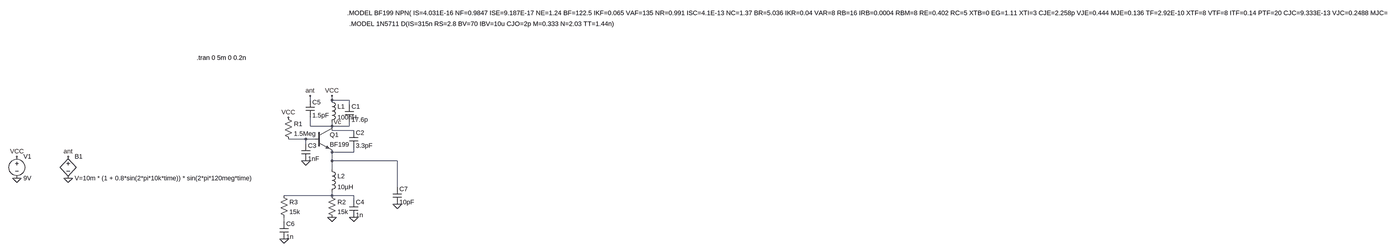
[diagram p0: schematic VHF Airband Receiver.asc, whole sheet]
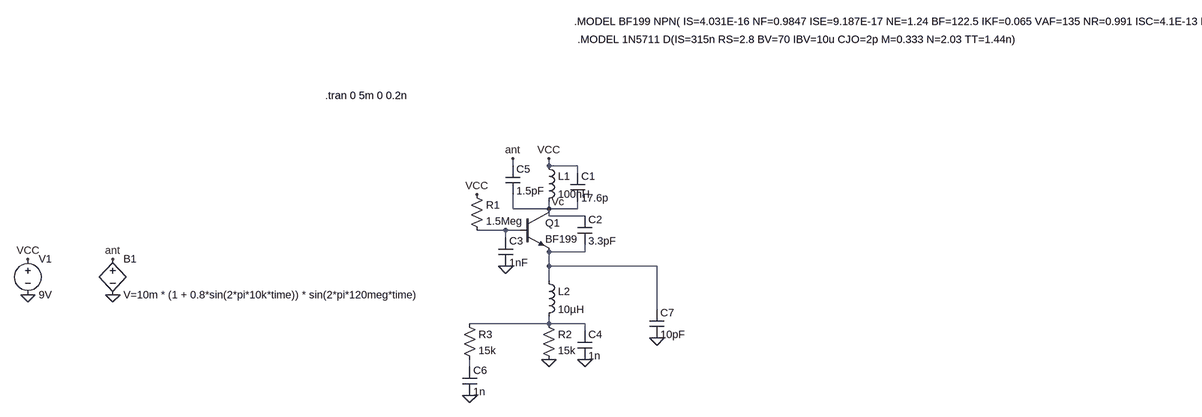
[diagram p1: schematic VHF Airband Receiver.asc, part, row 1 of 1, column 1 of 2]
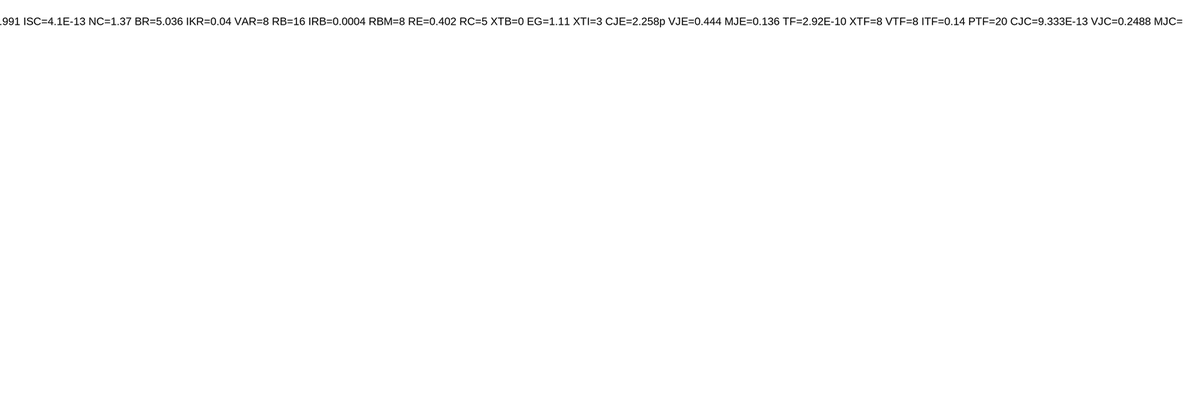
[diagram p2: schematic VHF Airband Receiver.asc, part, row 1 of 1, column 2 of 2]
VHF Airband Receiver.asc, the LTspice schematic file:
Version 4.1
SHEET 1 5172 1060
WIRE 112 320 112 304
WIRE 192 320 192 304
WIRE 256 320 192 320
WIRE 256 336 256 320
WIRE 112 416 112 384
WIRE 192 416 192 400
WIRE 192 416 112 416
WIRE 256 416 256 400
WIRE 256 416 192 416
WIRE 192 432 192 416
WIRE 272 432 192 432
WIRE 96 464 32 464
WIRE 128 464 96 464
WIRE 96 480 96 464
WIRE 272 512 272 496
WIRE 272 512 192 512
WIRE 192 544 192 512
WIRE 432 544 192 544
WIRE 192 576 192 544
WIRE 432 640 432 544
WIRE 192 672 192 656
WIRE 192 672 16 672
WIRE 272 672 192 672
WIRE 272 688 272 672
WIRE 16 768 16 752
FLAG -1056 608 0
FLAG -1056 528 VCC
FLAG 192 304 VCC
FLAG 192 416 Vc
FLAG 96 544 0
FLAG 32 384 VCC
FLAG 112 304 ant
FLAG 192 752 0
FLAG 272 752 0
FLAG 16 832 0
FLAG -864 608 0
FLAG -864 528 ant
FLAG 432 704 0
SYMBOL npn 128 416 R0
SYMATTR InstName Q1
SYMATTR Value BF199
SYMBOL voltage -1056 512 R0
WINDOW 123 0 0 Left 0
WINDOW 39 0 0 Left 0
SYMATTR InstName V1
SYMATTR Value 9V
SYMBOL ind 176 304 R0
SYMATTR InstName L1
SYMATTR Value 100nH
SYMATTR SpiceLine Rser=1m
SYMBOL cap 240 336 R0
SYMATTR InstName C1
SYMATTR Value 17.6p
SYMBOL cap 256 432 R0
SYMATTR InstName C2
SYMATTR Value 3.3pF
SYMBOL res 16 368 R0
SYMATTR InstName R1
SYMATTR Value 1.5Meg
SYMBOL cap 80 480 R0
SYMATTR InstName C3
SYMATTR Value 1nF
SYMBOL cap 96 320 R0
SYMATTR InstName C5
SYMATTR Value 1.5pF
SYMBOL ind 176 560 R0
SYMATTR InstName L2
SYMATTR Value 10µH
SYMATTR SpiceLine Rser=1m
SYMBOL res 176 656 R0
SYMATTR InstName R2
SYMATTR Value 15k
SYMBOL cap 256 688 R0
SYMATTR InstName C4
SYMATTR Value 1n
SYMBOL res 0 656 R0
SYMATTR InstName R3
SYMATTR Value 15k
SYMBOL cap 0 768 R0
SYMATTR InstName C6
SYMATTR Value 1n
SYMBOL cap 416 640 R0
SYMATTR InstName C7
SYMATTR Value 10pF
SYMBOL bv -864 512 R0
SYMATTR InstName B1
SYMATTR Value V=10m * (1 + 0.8*sin(2*pi*10k*time)) * sin(2*pi*120meg*time)
TEXT 248 -40 Left 2 !.MODEL BF199 NPN( IS=4.031E-16 NF=0.9847 ISE=9.187E-17 NE=1.24 BF=122.5 IKF=0.065 VAF=135 NR=0.991 ISC=4.1E-13 NC=1.37 BR=5.036 IKR=0.04 VAR=8 RB=16 IRB=0.0004 RBM=8 RE=0.402 RC=5 XTB=0 EG=1.11 XTI=3 CJE=2.258p VJE=0.444 MJE=0.136 TF=2.92E-10 XTF=8 VTF=8 ITF=0.14 PTF=20 CJC=9.333E-13 VJC=0.2488 MJC=0.1974 XCJC=0.86 TR=35n FC=0.9 Vceo=25 Icrating=25m mfg=Philips)
TEXT -392 144 Left 2 !.tran 0 5m 0 0.2n
TEXT 256 0 Left 2 !.MODEL 1N5711 D(IS=315n RS=2.8 BV=70 IBV=10u CJO=2p M=0.333 N=2.03 TT=1.44n)

The netlist it stands for:
* VHF Airband Receiver.asc
Q1 Vc N001 N002 0 BF199
V1 VCC 0 9V
L1 VCC Vc 100nH Rser=1m
C1 VCC Vc 17.6p
C2 Vc N002 3.3pF
R1 VCC N001 1.5Meg
C3 N001 0 1nF
C5 ant Vc 1.5pF
L2 N002 N003 10µH Rser=1m
R2 N003 0 15k
C4 N003 0 1n
R3 N003 N004 15k
C6 N004 0 1n
C7 N002 0 10pF
B1 ant 0 V=10m * (1 + 0.8*sin(2*pi*10k*time)) * sin(2*pi*120meg*time)
.model NPN NPN
.model PNP PNP
.lib standard.bjt
.MODEL BF199 NPN( IS=4.031E-16 NF=0.9847 ISE=9.187E-17 NE=1.24 BF=122.5 IKF=0.065 VAF=135 NR=0.991 ISC=4.1E-13 NC=1.37 BR=5.036 IKR=0.04 VAR=8 RB=16 IRB=0.0004 RBM=8 RE=0.402 RC=5 XTB=0 EG=1.11 XTI=3 CJE=2.258p VJE=0.444 MJE=0.136 TF=2.92E-10 XTF=8 VTF=8 ITF=0.14 PTF=20 CJC=9.333E-13 VJC=0.2488 MJC=0.1974 XCJC=0.86 TR=35n FC=0.9 Vceo=25 Icrating=25m mfg=Philips)
.tran 0 5m 0 0.2n
.MODEL 1N5711 D(IS=315n RS=2.8 BV=70 IBV=10u CJO=2p M=0.333 N=2.03 TT=1.44n)
.backanno
.end